# Altium project ArrowHheldPCB.PrjPcb
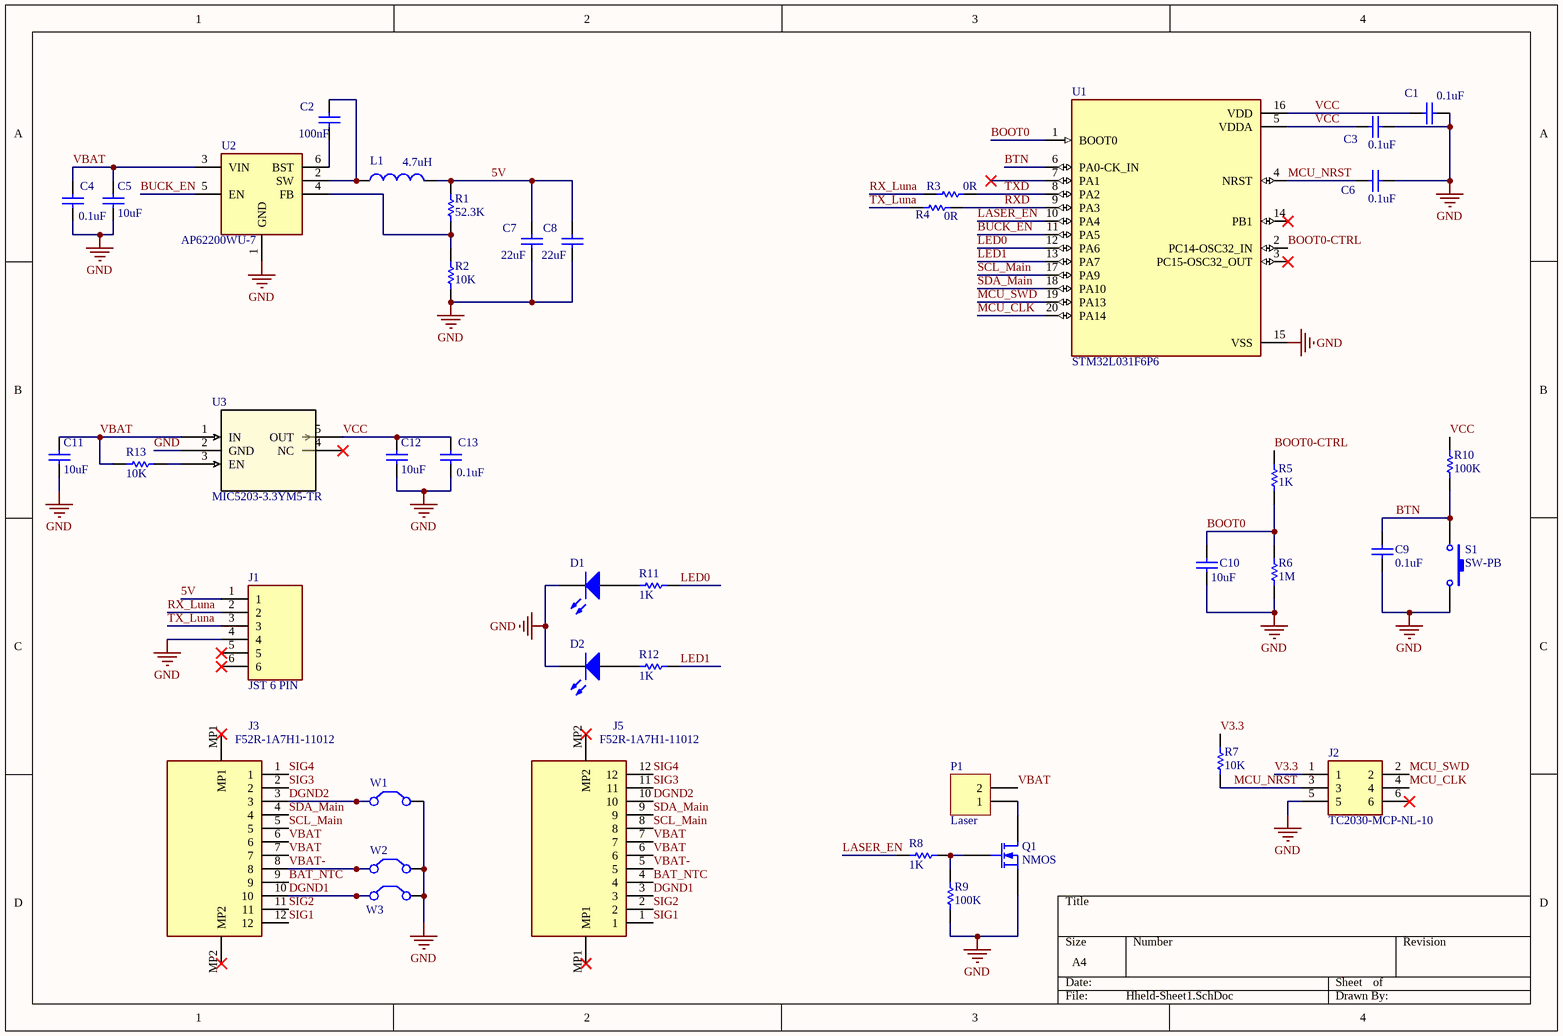
[diagram p0: Hheld-Sheet1.SchDoc]
1 sheet, 42 parts. Net scope: global (net labels, ports and power ports of the same name join across sheets).
Board file: ArrowHheldPCB.PcbDoc

## Sheet Hheld-Sheet1.SchDoc
size A4

### Parts
C1  value 0.1uF  [0402]
C2  value 100nF  [0402]
C3  value 0.1uF  [0402]
C4  value 0.1uF  [0402]
C5  value 10uF  [6-0805_L]
C6  value 0.1uF  [0402]
C7  value 22uF  [6-0805_L]
C8  value 22uF  [6-0805_L]
C9  value 0.1uF  [0402]
C10  value 10uF  [6-0805_L]
C11  value 10uF  [6-0805_L]
C12  value 10uF  [6-0805_L]
C13  value 0.1uF  [0402]
D1  (no value)  [1608[0603]]
D2  (no value)  [1608[0603]]
J1  JST 6 PIN  [SHDRRA6W50P0X200_1X6_1390X760X480P]
J2  TC2030-MCP-NL-10  [TC2030MCPNL10]
J3  F52R-1A7H1-11012  [F52R1A7H111012]
J5  F52R-1A7H1-11012  [F52R1A7H111012]
L1  value 4.7uH  [TYS50404R7N10]
P1  Laser  [MHDR1X2]
Q1  NMOS  [SOT65P210X100-3N]
R1  value 52.3K  [0402]
R2  value 10K  [0402]
R3  value 0R  [0402]
R4  value 0R  [0402]
R5  value 1K  [0402]
R6  value 1M  [0402]
R7  value 10K  [0402]
R8  value 1K  [0402]
R9  value 100K  [0402]
R10  value 100K  [0402]
R11  value 1K  [0402]
R12  value 1K  [0402]
R13  value 10K  [0402]
S1  SW-PB  [430456085736]
U1  STM32L031F6P6  [SOP65P640X120-20N]
U2  AP62200WU-7  [SOT95P280X100-6N]
U3  MIC5203-3.3YM5-TR  [SOT-23-5_M5_MCH]
W1  (no value)  [0402]
W2  (no value)  [0402]
W3  (no value)  [0402]

### Nets
GND: C1.2 C3.2 C4.1 C5.1 C6.2 C7.2 C8.2 C9.2 C10.1 C11.1 C12.1 C13.1 D1.2(K) D2.2(K) J1.4 J2.5 Q1.3(S) R2.2 R6.1 R9.1 S1.2 U1.15(VSS) U2.1(GND) U3.2(GND) W1.2(C2) W2.2(C2) W3.2(C2)
5V: C7.1 C8.1 J1.1 L1.2 R1.2
BAT_NTC: J3.9 J5.4
BOOT0: C10.2 R5.1 R6.2 U1.1(BOOT0)
BOOT0-CTRL: R5.2 U1.2(PC14-OSC32_IN)
BTN: C9.1 R10.1 S1.1 U1.6(PA0-CK_IN)
BUCK_EN: U1.11(PA5) U2.5(EN)
DGND1: J3.10 J5.3 W3.1(C1)
DGND2: J3.3 J5.10 W1.1(C1)
LASER_EN: R8.1 U1.10(PA4)
LED0: R11.2 U1.12(PA6)
LED1: R12.2 U1.13(PA7)
MCU_CLK: J2.4 U1.20(PA14)
MCU_NRST: C6.1 J2.3 R7.1 U1.4(NRST)
MCU_SWD: J2.2 U1.19(PA13)
RX_Luna: J1.2 R3.2
RXD: R4.1 U1.9(PA3)
SCL_Main: J3.5 J5.8 U1.17(PA9)
SDA_Main: J3.4 J5.9 U1.18(PA10)
SIG1: J3.12 J5.1
SIG2: J3.11 J5.2
SIG3: J3.2 J5.11
SIG4: J3.1 J5.12
TX_Luna: J1.3 R4.2
TXD: R3.1 U1.8(PA2)
V3.3: J2.1 R7.2
VBAT: C4.2 C5.2 C11.2 J3.6 J3.7 J5.6 J5.7 P1.2 R13.1 U2.3(VIN) U3.1(IN)
VBAT-: J3.8 J5.5 W2.1(C1)
VCC: C1.1 C3.1 C12.2 C13.2 R10.2 U1.5(VDDA) U1.16(VDD) U3.5(OUT)
NetC2_1: C2.1 L1.1 U2.2(SW)
NetC2_2: C2.2 U2.6(BST)
NetD1_1: D1.1(A) R11.1
NetD2_1: D2.1(A) R12.1
NetP1_1: P1.1 Q1.1(D)
NetQ1_2: Q1.2(G) R8.2 R9.2
NetR1_1: R1.1 R2.1 U2.4(FB)
NetR13_2: R13.2 U3.3(EN)

Not connected (* = marked no-connect by the designer): J1 5* 6*; J2 6*; J3 MP1* MP2*; J5 MP1* MP2*; U1 3(PC15-OSC32_OUT)* 7(PA1)* 14(PB1)*; U3 4(NC)*

### Library data of the parts
C1 C2 C5 C7 C8 C10-C12 = Cap: Capacitor; Published: 8-Jun-2000; LatestRevisionDate: 17-Jul-2002; LatestRevisionNote: Re-released for DXP Platform.; PackageReference: RAD-0.3; Publisher: Altium Limited; PackageDescription: Radial Cap, Thru-Hole; 2 Leads; 0.3 in Pin Spacing; P/N: *
C3 C4 C6 C9 C13 = Cap: Capacitor; P/N: CL05A104KA5NNNC; Published: 8-Jun-2000; LatestRevisionDate: 17-Jul-2002; LatestRevisionNote: Re-released for DXP Platform.; PackageReference: RAD-0.3; Publisher: Altium Limited; PackageDescription: Radial Cap, Thru-Hole; 2 Leads; 0.3 in Pin Spacing
D1 D2 = LED0: Typical INFRARED GaAs LED; Published: 8-Jun-2000; LatestRevisionDate: 08-Jul-2005; LatestRevisionNote: Mech Layer 1 removed.; PackageReference: LED-0; Publisher: Altium Limited; PackageDescription: LED; 2 Leads
J1 = S6B-PH-K-S_LF__SN_: Connector; Manufacturer_Name: JST (JAPAN SOLDERLESS TERMINALS); Manufacturer_Part_Number: S6B-PH-K-S(LF)(SN); Datasheet Link: http://www.jst-mfg.com/product/pdf/eng/ePH.pdf; Height: 4.8mm; Arrow Part Number: S6B-PH-K-S(LF)(SN); Arrow Price/Stock: https://www.arrow.com/en/products/s6b-ph-k-s-lf-sn/jst-manufacturing?region=nac
J2 = TC2030-MCP-NL-10: Connector; Manufacturer_Name: Tag Connect; Datasheet Link: https://datasheet.datasheetarchive.com/originals/distributors/Datasheets_SAMA/69d9de5c4f3ef6f122772fd5d7b0f8ab.pdf; Height: 18mm; Manufacturer_Part_Number: TC2030-MCP-NL-10; P/N: *
J3 J5 = F52R-1A7H1-11012: Connector; Manufacturer_Name: AMPHENOL COMMUNICATION SOLUTIONS; Datasheet Link: https://cdn.amphenol-cs.com/media/wysiwyg/files/drawing/f52r.pdf; Height: 2.2mm; Manufacturer_Part_Number: F52R-1A7H1-11012; Arrow Part Number: F52R-1A7H1-11012; Arrow Price/Stock: https://www.arrow.com/en/products/f52r-1a7h1-11012/amphenol-fci?region=nac
L1 = Inductor: Code_IEC: 1005; Published: 8-Jun-2000; LatestRevisionDate: 29-May-2009; LatestRevisionNote: IPC-7351 Footprint Added.; PackageReference: 0402-A; Publisher: Altium Limited; PackageDescription: Chip Inductor; Code_JEITA: 0402; P/N: *
P1 = MHDR1X2: Header, 2-Pin; LatestRevisionDate: 17-Jul-2002; LatestRevisionNote: Re-released for DXP Platform.; Publisher: Altium Limited
Q1 = MOSFET-N: N-Channel MOSFETBSS214NWH6327XTSA1; Published: 8-Jun-2000; LatestRevisionDate: 17-Jul-2002; LatestRevisionNote: Re-released for DXP Platform.; PackageVersion: 1995/1996; PackageReference: E3; Publisher: Altium Limited; PackageDescription: TO, Flat Index; 3 In-Line, Axial Leads; Body Dia. 4.6mm; Lead Dia. 0.5 mm (max)
R1-R13 = Res Semi: Semiconductor Resistor; Published: 8-Jun-2000; LatestRevisionDate: 17-Jul-2002; LatestRevisionNote: Re-released for DXP Platform.; PackageReference: AXIAL-0.5; Publisher: Altium Limited; PackageDescription: Axial Device, Thru-Hole; 2 Leads; 0.5 in Pin Spacing; P/N: *
S1 = SW-PB: Switch; Published: 24-Mar-1999; LatestRevisionDate: 17-Jul-2002; LatestRevisionNote: Re-released for DXP Platform.; PackageReference: SPST-2; Publisher: Altium Limited; PackageDescription: Switch; 2 Leads; P/N: *
U1 = STM32L031F6P6: Ultra-low-power ARM Cortex-M0+ MCU with 32-Kbytes Flash, 32 MHz CPU; MF: {'manufacturer': u'STMicroelectronics'}; Value: *; Package: None; MP: STM32L031F6P6; Price: None; Availability: Unavailable; P/N: *
U2 = AP62200WU-7: Integrated Circuit; Manufacturer_Name: Diodes Inc.; Datasheet Link: https://datasheet.datasheetarchive.com/originals/distributors/Datasheets_SAMA/8773719cd56c9c8fb48ffd720a0376ce.pdf; Height: 1mm; Manufacturer_Part_Number: AP62200WU-7; Mouser Part Number: 621-AP62200WU-7; Mouser Price/Stock: https://www.mouser.co.uk/ProductDetail/Diodes-Incorporated/AP62200WU-7?qs=P1JMDcb91o6Lrrt3Idazjw%3D%3D; Arrow Part Number: AP62200WU-7; Arrow Price/Stock: https://www.arrow.com/en/products/ap62200wu-7/diodes-incorporated?region=nac
U3 = MIC5203-3.3YM5-TR: No Description Available; Mfr_Name: Microchip; Copyright: Copyright (C) 2022 Ultra Librarian. All rights reserved.; Manufacturer_Part_Number: MIC5203-3.3YM5-TR; Digi-Key_Part_Number_1: 576-2728-1-ND; Digi-Key_Part_Number_2: 576-2728-2-ND; Digi-Key_Part_Number_3: 576-2728-6-ND; RefDes: RefDes; Type: DEV
W1-W3 = Jumper: Jumper Wire; Published: 24-Mar-1999; LatestRevisionDate: 17-Jul-2002; LatestRevisionNote: Re-released for DXP Platform.; PackageReference: RAD-0.2; Publisher: Altium Limited; PackageDescription: Radial Cap, Thru-Hole; 2 Leads; 0.2 in Pin Spacing; P/N: *